# EAGLE design Thermocouple_Test (EAGLE 6.4)
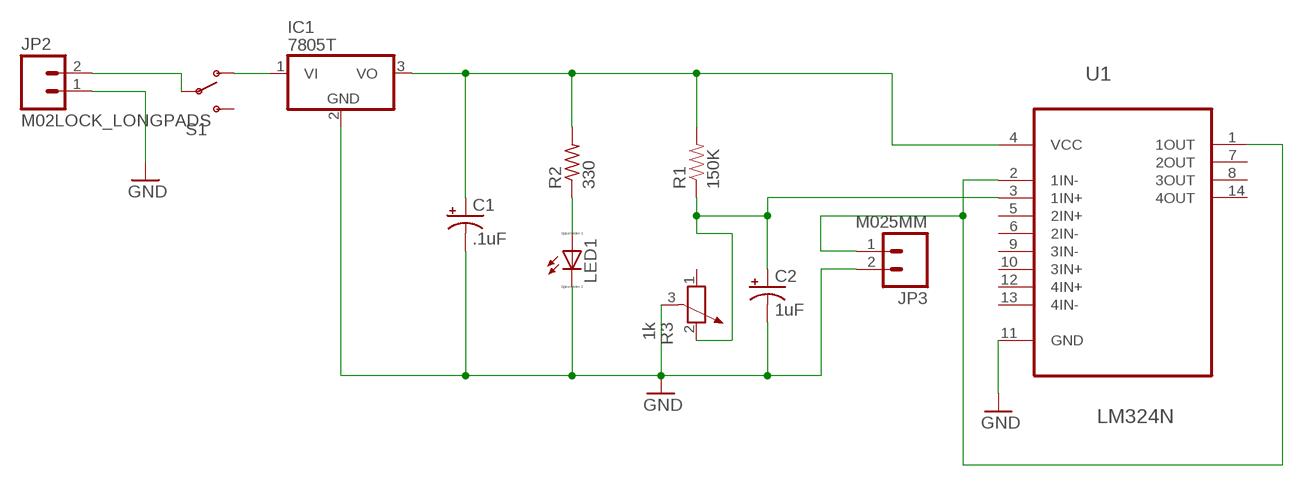
[diagram p0: schematic, sheet 1]

## Parts
C1  .1uF  10UF-25V-20%(PTH)KIT  [CPOL-RADIAL-10UF-25V-KIT]
C2  1uF  10UF-25V-20%(PTH)KIT  [CPOL-RADIAL-10UF-25V-KIT]
IC1  7805T  [TO220H]
JP2  M02LOCK_LONGPADS  [1X02_LOCK_LONGPADS]
JP3  M025MM  [SCREWTERMINAL-5MM-2]
LED1  LED_ELD260  [LED_LD260]
R1  150K  RESISTORPTH-1/2W  [AXIAL-0.5]
R2  330  R-US_0204/7  [0204/7]
R3  1k  POTENTIOMETER_PT_SPIN  [PT-SPIN]
S1  SWITCH-SPDTPTH  [SWITCH-SPDT]
U1  LM324N  [DIP254P762X508-14]

## Nets
GND: C1.2(-) C2.2(-) IC1.2(GND) JP2.1 JP3.2 LED1.K(C) R3.3 U1.11(GND)
N$1: C1.1(+) IC1.3(VO) R1.P$2 R2.2 U1.4(VCC)
N$2: C2.1(+) R1.P$1 R3.2 U1.3(1IN+)
N$3: JP3.1 U1.1(1OUT) U1.2(1IN-)
N$4: LED1.A R2.1
N$5: IC1.1(VI) S1.1(O)
N$6: JP2.2 S1.2(P)
Unconnected: R3.1 S1.3(S) U1.5(2IN+) U1.6(2IN-) U1.7(2OUT) U1.8(3OUT) U1.9(3IN-) U1.10(3IN+) U1.12(4IN+) U1.13(4IN-) U1.14(4OUT)

## Library data of the parts
C1 C2 = SparkFun-Capacitors:10UF-25V-20%(PTH): CAP-08440; PROD_ID: CAP-08440
IC1 = linear:78*: Positive VOLTAGE REGULATOR Source: http://cache.national.com/ds/LM/LM78L05.pdf http://www.fairchildsemi.com/ds/LM/LM7805.pdf
JP2 = SparkFun-Connectors:M02: Standard 2-pin 0.1" header. Use with - straight break away headers ( PRT-00116) - right angle break away headers (PRT-00553) - swiss pins (PRT-00743) - machine pins (PRT-00117) - female headers (PRT-00115) Molex polarized connector foot print use with: PRT-08233 with associated crimp pins and housings. 2.54_SCREWTERM for use with PRT-10571. 3.5mm Screw Terminal footprints for PRT-08084 5mm Screw Terminal footprints for use with PRT-08432
JP3 = SparkFun-Connectors:M02: Standard 2-pin 0.1" header. Use with - straight break away headers ( PRT-00116) - right angle break away headers (PRT-00553) - swiss pins (PRT-00743) - machine pins (PRT-00117) - female headers (PRT-00115) Molex polarized connector foot print use with: PRT-08233 with associated crimp pins and housings. 2.54_SCREWTERM for use with PRT-10571. 3.5mm Screw Terminal footprints for PRT-08084 5mm Screw Terminal footprints for use with PRT-08432; STOREFRONT_ID: PRT-08432
LED1 = eagle-ltspice:LED_E: LED Source: http://www.osram.convergy.de Source: www.luxeon.com Source: www.kingbright.com; SPICEMODEL: NONE; SPICEPREFIX: D; SPICETYPE: diode
R1 = SparkFun-Resistors:RESISTOR: Resistor Basic schematic elements and footprints for 0603, 1206, and PTH resistors.
R2 = resistor:R-US_: RESISTOR, American symbol
R3 = rcl:POTENTIOMETER_: Potentiometer
S1 = SparkFun-Electromechanical:SWITCH-SPDT: SPDT Switch Simple slide switch, Spark Fun Electronics SKU : COM-00102 DPDT SMT slide switch, AYZ0202, SWCH-08179
U1 = Texas Instruments_By_element14_Batch_1:LM324N: QUADRUPLE OPERATIONAL AMPLIFIERS; MPN: LM324N; OC_FARNELL: 9755926; OC_NEWARK: 60K6190; PACKAGE: DIP-14; SUPPLIER: Texas Instruments

## Board
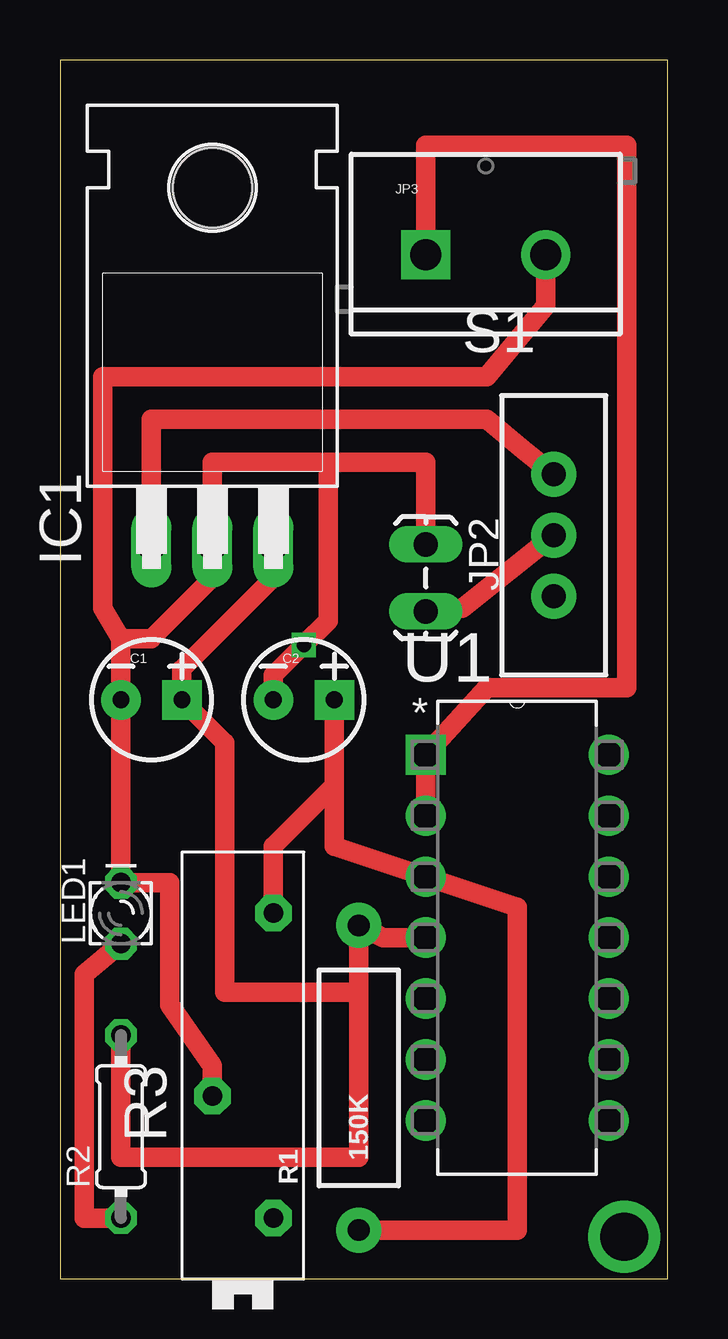
[diagram p1: board, top side]
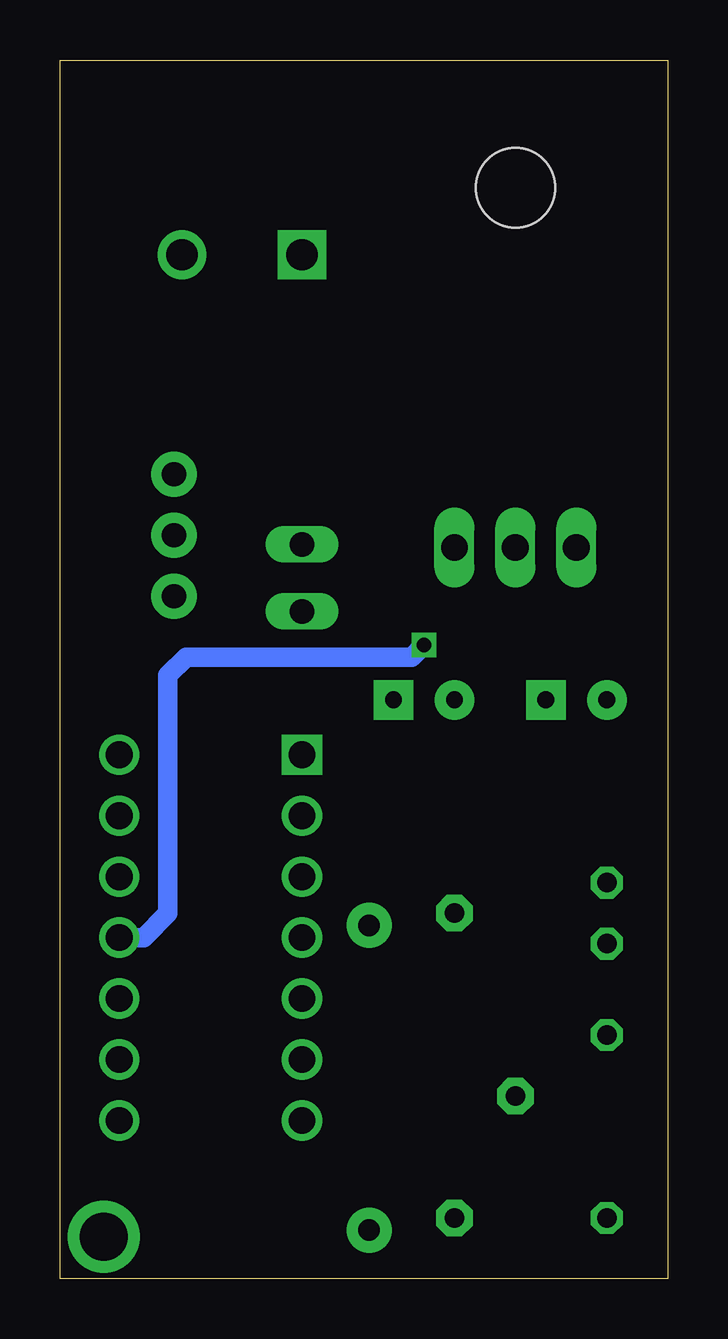
[diagram p2: board, bottom side, seen from below]

Size 25.32 x 50.79 mm. Coordinates in mm from the lower left corner, seen from the top.
Outline: 0,0 25.32,0 25.32,50.79 0,50.79 0,0
Copper layers (1*16): Top 0.035mm / dielectric 1.5mm / Bottom 0.035mm
Design rules "Etch *": minimum track width 1.8mm, minimum drill 0.8mm, track to track 0.8mm, track to pad 0.8mm, pad to pad 0.45mm, via to via 0.8mm, smd to smd 12mil, copper to edge 40mil, drill to drill 8mil, minimum pad ring 10mil, minimum via ring 8mil, stop-mask expansion 4mil, vias tented up to drill 0mil, thermal gap 10mil

### Footprints (pad centres in the part's own frame; a part is rotated, then mirrored left to right if it is on the bottom)
CPOL-RADIAL-10UF-25V-KIT = drill 0.7 pad 1.651 square: 1 1.27,0 | drill 0.7 pad 1.651: 2 -1.27,0
TO220H = drill 1.118 long: 1 -2.54,-10.16; 2 0,-10.16; 3 2.54,-10.16 | hole 3.302: 0,4.826
1X02_LOCK_LONGPADS = drill 1.016 long: 1 -0.127,0; 2 2.667,0
SCREWTERMINAL-5MM-2 = drill 1.3 pad 2.032 square: 1 0,0 | drill 1.3 pad 2.032: 2 5,0
LED_LD260 = drill 0.813 octagon: A -1.27,0; K 1.27,0
AXIAL-0.5 = drill 0.9 pad 1.88: P$1 -6.35,0; P$2 6.35,0
0204/7 = drill 0.813 octagon: 1 -3.81,0; 2 3.81,0
PT-SPIN = drill 0.813 pad 1.524 octagon: 1 -6.35,-1.27; 2 6.35,-1.27; 3 -1.27,1.27
SWITCH-SPDT = drill 1.016 pad 1.88: 1 0,2.54; 2 0,0; 3 0,-2.54
DIP254P762X508-14 = drill 1.118 square: 1 -7.62,15.24 | drill 1.118: 2 -7.62,12.7; 3 -7.62,10.16; 4 -7.62,7.62; 5 -7.62,5.08; 6 -7.62,2.54; 7 -7.62,0; 8 0,0; 9 0,2.54; 10 0,5.08; 11 0,7.62; 12 0,10.16; 13 0,12.7; 14 0,15.24

### Placement (x,y rotation side)
C1  3.81,24.13 0 top
C2  10.16,24.13 0 top
IC1  6.35,40.64 0 top
JP2  15.24,30.48 270 top
JP3  15.24,42.67 0 top
LED1  2.54,15.24 90 top
R1  12.45,8.38 90 top
R2  2.54,6.35 90 top
R3  7.62,8.89 90 top
S1  20.57,30.99 0 top
U1  22.86,6.6 0 top

### Tracks (layer width: path | path; a pad name or v marks a point on that pad's centre or on a via)
GND  (via drill 0.6)
  Top 0.813: R3.3 6.35,8.89 4.57,11.43 4.57,16.51 LED1.K C1.2 2.54,26.67 | 2.54,26.67 3.81,26.67 6.35,29.21 IC1.2 6.35,34.04 11.18,34.04 | JP3.2 20.24,40.56 17.78,37.59 1.78,37.59 1.78,27.94 2.54,26.67 | C2.2 8.89,25.15 v10.16,26.42 11.18,27.43 11.18,34.04 | 11.18,34.04 15.24,34.04 JP2.1
  Bottom 0.813: U1.11 21.84,14.22 20.83,15.24 20.83,25.15 20.07,25.91 10.67,25.91 v10.16,26.42
N$1
  Top 0.813: U1.4 13.46,14.22 R1.P$2 12.45,11.94 | 12.45,11.94 12.45,5.08 2.54,5.08 R2.2 | IC1.3 8.89,29.21 5.08,25.4 C1.1 6.86,22.35 6.86,11.94 12.45,11.94
N$2
  Top 0.813: 11.43,20.57 11.43,18.03 U1.3 19.05,15.49 19.05,2.03 R1.P$1 | 11.43,20.57 C2.1 | 11.43,20.57 8.89,18.03 R3.2
N$3
  Top 0.813: U1.2 U1.1 17.78,24.64 23.62,24.64 23.62,47.24 15.24,47.24 JP3.1
N$4
  Top 0.813: R2.1 1.02,2.54 1.02,12.7 LED1.A
N$5
  Top 0.813: S1.1 19.3,34.54 17.78,35.81 3.81,35.81 IC1.1
N$6
  Top 0.813: S1.2 16.76,27.94 JP2.2
N$7  (via drill 2 pad 0.25)
  other vias: 23.5,1.75